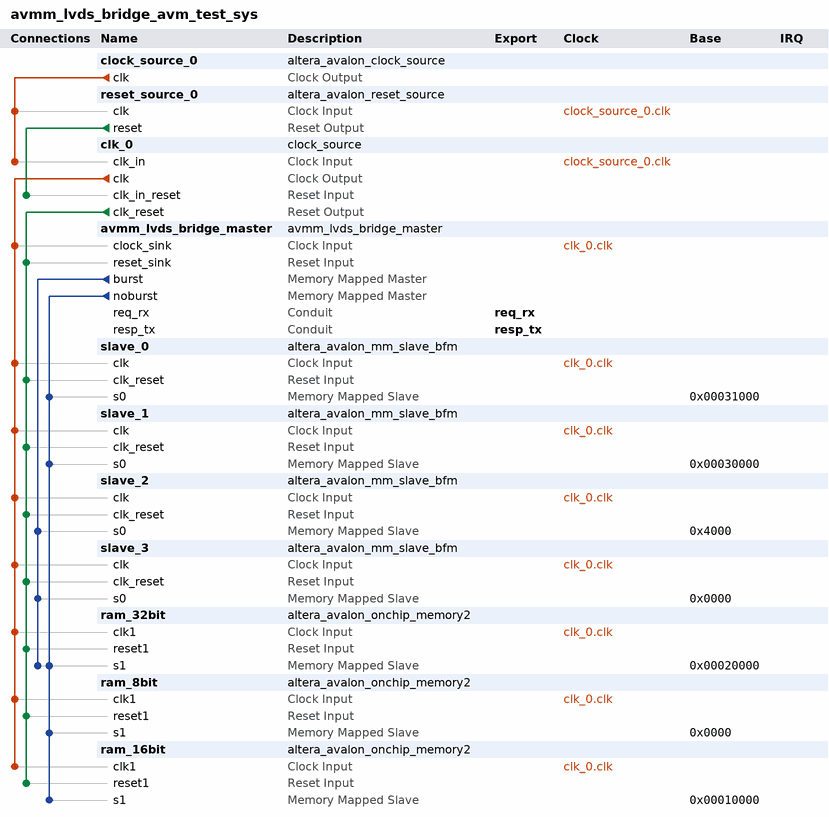
[diagram p0: system contents]
# Platform Designer (Qsys) system avmm_lvds_bridge_avm_test_sys, Cyclone V 5CEBA2F17A7
# Parameters at their usual value, and those the tool derives, are not listed.
package require -exact qsys 15.1
create_system avmm_lvds_bridge_avm_test_sys
set_project_property DEVICE_FAMILY {Cyclone V}
set_project_property DEVICE 5CEBA2F17A7

add_instance clock_source_0 altera_avalon_clock_source 15.1
set_instance_parameter_value clock_source_0 CLOCK_RATE 100
set_instance_parameter_value clock_source_0 CLOCK_UNIT 1000000

add_instance reset_source_0 altera_avalon_reset_source 15.1
set_instance_parameter_value reset_source_0 ASSERT_HIGH_RESET 1
set_instance_parameter_value reset_source_0 INITIAL_RESET_CYCLES 2

add_instance clk_0 clock_source 15.1
set_instance_parameter_value clk_0 clockFrequency 100000000

add_instance avmm_lvds_bridge_master avmm_lvds_bridge_master 1.0
set_instance_parameter_value avmm_lvds_bridge_master ADDR_W 19
set_instance_parameter_value avmm_lvds_bridge_master BURSTCNT_W 11
set_instance_parameter_value avmm_lvds_bridge_master REQ_FACTOR 1
set_instance_parameter_value avmm_lvds_bridge_master RESP_FACTOR 1

add_instance slave_0 altera_avalon_mm_slave_bfm 15.1
set_instance_parameter_value slave_0 ADDRESS_UNITS WORDS
set_instance_parameter_value slave_0 ASSERT_HIGH_ARBITERLOCK 1
set_instance_parameter_value slave_0 ASSERT_HIGH_BYTEENABLE 1
set_instance_parameter_value slave_0 ASSERT_HIGH_LOCK 1
set_instance_parameter_value slave_0 ASSERT_HIGH_READ 1
set_instance_parameter_value slave_0 ASSERT_HIGH_READDATAVALID 1
set_instance_parameter_value slave_0 ASSERT_HIGH_RESET 1
set_instance_parameter_value slave_0 ASSERT_HIGH_WAITREQUEST 1
set_instance_parameter_value slave_0 ASSERT_HIGH_WRITE 1
set_instance_parameter_value slave_0 AV_ADDRESS_W 10
set_instance_parameter_value slave_0 AV_BURSTCOUNT_W 3
set_instance_parameter_value slave_0 AV_BURST_BNDR_ONLY 1
set_instance_parameter_value slave_0 AV_BURST_LINEWRAP 1
set_instance_parameter_value slave_0 AV_FIX_READ_LATENCY 0
set_instance_parameter_value slave_0 AV_MAX_PENDING_READS 1
set_instance_parameter_value slave_0 AV_MAX_PENDING_WRITES 0
set_instance_parameter_value slave_0 AV_NUMSYMBOLS 4
set_instance_parameter_value slave_0 AV_READRESPONSE_W 8
set_instance_parameter_value slave_0 AV_READ_WAIT_TIME 1
set_instance_parameter_value slave_0 AV_REGISTERINCOMINGSIGNALS 0
set_instance_parameter_value slave_0 AV_SYMBOL_W 8
set_instance_parameter_value slave_0 AV_WRITERESPONSE_W 8
set_instance_parameter_value slave_0 AV_WRITE_WAIT_TIME 0
set_instance_parameter_value slave_0 REGISTER_WAITREQUEST 0
set_instance_parameter_value slave_0 USE_ADDRESS 1
set_instance_parameter_value slave_0 USE_ARBITERLOCK 0
set_instance_parameter_value slave_0 USE_BEGIN_BURST_TRANSFER 0
set_instance_parameter_value slave_0 USE_BEGIN_TRANSFER 0
set_instance_parameter_value slave_0 USE_BURSTCOUNT 1
set_instance_parameter_value slave_0 USE_BYTE_ENABLE 1
set_instance_parameter_value slave_0 USE_CLKEN 0
set_instance_parameter_value slave_0 USE_DEBUGACCESS 0
set_instance_parameter_value slave_0 USE_LOCK 0
set_instance_parameter_value slave_0 USE_READ 1
set_instance_parameter_value slave_0 USE_READRESPONSE 0
set_instance_parameter_value slave_0 USE_READ_DATA 1
set_instance_parameter_value slave_0 USE_READ_DATA_VALID 1
set_instance_parameter_value slave_0 USE_TRANSACTIONID 0
set_instance_parameter_value slave_0 USE_WAIT_REQUEST 1
set_instance_parameter_value slave_0 USE_WRITE 1
set_instance_parameter_value slave_0 USE_WRITERESPONSE 0
set_instance_parameter_value slave_0 USE_WRITE_DATA 1
set_instance_parameter_value slave_0 VHDL_ID 0

add_instance slave_1 altera_avalon_mm_slave_bfm 15.1
set_instance_parameter_value slave_1 ADDRESS_UNITS WORDS
set_instance_parameter_value slave_1 ASSERT_HIGH_ARBITERLOCK 1
set_instance_parameter_value slave_1 ASSERT_HIGH_BYTEENABLE 1
set_instance_parameter_value slave_1 ASSERT_HIGH_LOCK 1
set_instance_parameter_value slave_1 ASSERT_HIGH_READ 1
set_instance_parameter_value slave_1 ASSERT_HIGH_READDATAVALID 1
set_instance_parameter_value slave_1 ASSERT_HIGH_RESET 1
set_instance_parameter_value slave_1 ASSERT_HIGH_WAITREQUEST 1
set_instance_parameter_value slave_1 ASSERT_HIGH_WRITE 1
set_instance_parameter_value slave_1 AV_ADDRESS_W 10
set_instance_parameter_value slave_1 AV_BURSTCOUNT_W 3
set_instance_parameter_value slave_1 AV_BURST_BNDR_ONLY 1
set_instance_parameter_value slave_1 AV_BURST_LINEWRAP 1
set_instance_parameter_value slave_1 AV_FIX_READ_LATENCY 0
set_instance_parameter_value slave_1 AV_MAX_PENDING_READS 1
set_instance_parameter_value slave_1 AV_MAX_PENDING_WRITES 0
set_instance_parameter_value slave_1 AV_NUMSYMBOLS 4
set_instance_parameter_value slave_1 AV_READRESPONSE_W 8
set_instance_parameter_value slave_1 AV_READ_WAIT_TIME 1
set_instance_parameter_value slave_1 AV_REGISTERINCOMINGSIGNALS 0
set_instance_parameter_value slave_1 AV_SYMBOL_W 8
set_instance_parameter_value slave_1 AV_WRITERESPONSE_W 8
set_instance_parameter_value slave_1 AV_WRITE_WAIT_TIME 0
set_instance_parameter_value slave_1 REGISTER_WAITREQUEST 0
set_instance_parameter_value slave_1 USE_ADDRESS 1
set_instance_parameter_value slave_1 USE_ARBITERLOCK 0
set_instance_parameter_value slave_1 USE_BEGIN_BURST_TRANSFER 0
set_instance_parameter_value slave_1 USE_BEGIN_TRANSFER 0
set_instance_parameter_value slave_1 USE_BURSTCOUNT 1
set_instance_parameter_value slave_1 USE_BYTE_ENABLE 1
set_instance_parameter_value slave_1 USE_CLKEN 0
set_instance_parameter_value slave_1 USE_DEBUGACCESS 0
set_instance_parameter_value slave_1 USE_LOCK 0
set_instance_parameter_value slave_1 USE_READ 1
set_instance_parameter_value slave_1 USE_READRESPONSE 0
set_instance_parameter_value slave_1 USE_READ_DATA 1
set_instance_parameter_value slave_1 USE_READ_DATA_VALID 1
set_instance_parameter_value slave_1 USE_TRANSACTIONID 0
set_instance_parameter_value slave_1 USE_WAIT_REQUEST 1
set_instance_parameter_value slave_1 USE_WRITE 1
set_instance_parameter_value slave_1 USE_WRITERESPONSE 0
set_instance_parameter_value slave_1 USE_WRITE_DATA 1
set_instance_parameter_value slave_1 VHDL_ID 0

add_instance slave_2 altera_avalon_mm_slave_bfm 15.1
set_instance_parameter_value slave_2 ADDRESS_UNITS WORDS
set_instance_parameter_value slave_2 ASSERT_HIGH_ARBITERLOCK 1
set_instance_parameter_value slave_2 ASSERT_HIGH_BYTEENABLE 1
set_instance_parameter_value slave_2 ASSERT_HIGH_LOCK 1
set_instance_parameter_value slave_2 ASSERT_HIGH_READ 1
set_instance_parameter_value slave_2 ASSERT_HIGH_READDATAVALID 1
set_instance_parameter_value slave_2 ASSERT_HIGH_RESET 1
set_instance_parameter_value slave_2 ASSERT_HIGH_WAITREQUEST 1
set_instance_parameter_value slave_2 ASSERT_HIGH_WRITE 1
set_instance_parameter_value slave_2 AV_ADDRESS_W 12
set_instance_parameter_value slave_2 AV_BURSTCOUNT_W 11
set_instance_parameter_value slave_2 AV_BURST_BNDR_ONLY 1
set_instance_parameter_value slave_2 AV_BURST_LINEWRAP 1
set_instance_parameter_value slave_2 AV_FIX_READ_LATENCY 0
set_instance_parameter_value slave_2 AV_MAX_PENDING_READS 1
set_instance_parameter_value slave_2 AV_MAX_PENDING_WRITES 0
set_instance_parameter_value slave_2 AV_NUMSYMBOLS 4
set_instance_parameter_value slave_2 AV_READRESPONSE_W 8
set_instance_parameter_value slave_2 AV_READ_WAIT_TIME 1
set_instance_parameter_value slave_2 AV_REGISTERINCOMINGSIGNALS 0
set_instance_parameter_value slave_2 AV_SYMBOL_W 8
set_instance_parameter_value slave_2 AV_WRITERESPONSE_W 8
set_instance_parameter_value slave_2 AV_WRITE_WAIT_TIME 0
set_instance_parameter_value slave_2 REGISTER_WAITREQUEST 0
set_instance_parameter_value slave_2 USE_ADDRESS 1
set_instance_parameter_value slave_2 USE_ARBITERLOCK 0
set_instance_parameter_value slave_2 USE_BEGIN_BURST_TRANSFER 0
set_instance_parameter_value slave_2 USE_BEGIN_TRANSFER 0
set_instance_parameter_value slave_2 USE_BURSTCOUNT 1
set_instance_parameter_value slave_2 USE_BYTE_ENABLE 1
set_instance_parameter_value slave_2 USE_CLKEN 0
set_instance_parameter_value slave_2 USE_DEBUGACCESS 0
set_instance_parameter_value slave_2 USE_LOCK 0
set_instance_parameter_value slave_2 USE_READ 1
set_instance_parameter_value slave_2 USE_READRESPONSE 0
set_instance_parameter_value slave_2 USE_READ_DATA 1
set_instance_parameter_value slave_2 USE_READ_DATA_VALID 1
set_instance_parameter_value slave_2 USE_TRANSACTIONID 0
set_instance_parameter_value slave_2 USE_WAIT_REQUEST 1
set_instance_parameter_value slave_2 USE_WRITE 1
set_instance_parameter_value slave_2 USE_WRITERESPONSE 0
set_instance_parameter_value slave_2 USE_WRITE_DATA 1
set_instance_parameter_value slave_2 VHDL_ID 0

add_instance slave_3 altera_avalon_mm_slave_bfm 15.1
set_instance_parameter_value slave_3 ADDRESS_UNITS WORDS
set_instance_parameter_value slave_3 ASSERT_HIGH_ARBITERLOCK 1
set_instance_parameter_value slave_3 ASSERT_HIGH_BYTEENABLE 1
set_instance_parameter_value slave_3 ASSERT_HIGH_LOCK 1
set_instance_parameter_value slave_3 ASSERT_HIGH_READ 1
set_instance_parameter_value slave_3 ASSERT_HIGH_READDATAVALID 1
set_instance_parameter_value slave_3 ASSERT_HIGH_RESET 1
set_instance_parameter_value slave_3 ASSERT_HIGH_WAITREQUEST 1
set_instance_parameter_value slave_3 ASSERT_HIGH_WRITE 1
set_instance_parameter_value slave_3 AV_ADDRESS_W 12
set_instance_parameter_value slave_3 AV_BURSTCOUNT_W 10
set_instance_parameter_value slave_3 AV_BURST_BNDR_ONLY 1
set_instance_parameter_value slave_3 AV_BURST_LINEWRAP 1
set_instance_parameter_value slave_3 AV_FIX_READ_LATENCY 0
set_instance_parameter_value slave_3 AV_MAX_PENDING_READS 1
set_instance_parameter_value slave_3 AV_MAX_PENDING_WRITES 0
set_instance_parameter_value slave_3 AV_NUMSYMBOLS 4
set_instance_parameter_value slave_3 AV_READRESPONSE_W 8
set_instance_parameter_value slave_3 AV_READ_WAIT_TIME 1
set_instance_parameter_value slave_3 AV_REGISTERINCOMINGSIGNALS 0
set_instance_parameter_value slave_3 AV_SYMBOL_W 8
set_instance_parameter_value slave_3 AV_WRITERESPONSE_W 8
set_instance_parameter_value slave_3 AV_WRITE_WAIT_TIME 0
set_instance_parameter_value slave_3 REGISTER_WAITREQUEST 0
set_instance_parameter_value slave_3 USE_ADDRESS 1
set_instance_parameter_value slave_3 USE_ARBITERLOCK 0
set_instance_parameter_value slave_3 USE_BEGIN_BURST_TRANSFER 0
set_instance_parameter_value slave_3 USE_BEGIN_TRANSFER 0
set_instance_parameter_value slave_3 USE_BURSTCOUNT 1
set_instance_parameter_value slave_3 USE_BYTE_ENABLE 1
set_instance_parameter_value slave_3 USE_CLKEN 0
set_instance_parameter_value slave_3 USE_DEBUGACCESS 0
set_instance_parameter_value slave_3 USE_LOCK 0
set_instance_parameter_value slave_3 USE_READ 1
set_instance_parameter_value slave_3 USE_READRESPONSE 0
set_instance_parameter_value slave_3 USE_READ_DATA 1
set_instance_parameter_value slave_3 USE_READ_DATA_VALID 1
set_instance_parameter_value slave_3 USE_TRANSACTIONID 0
set_instance_parameter_value slave_3 USE_WAIT_REQUEST 1
set_instance_parameter_value slave_3 USE_WRITE 1
set_instance_parameter_value slave_3 USE_WRITERESPONSE 0
set_instance_parameter_value slave_3 USE_WRITE_DATA 1
set_instance_parameter_value slave_3 VHDL_ID 0

add_instance ram_32bit altera_avalon_onchip_memory2 15.1
set_instance_parameter_value ram_32bit dataWidth 32
set_instance_parameter_value ram_32bit dualPort false
set_instance_parameter_value ram_32bit initMemContent false
set_instance_parameter_value ram_32bit initializationFileName onchip_mem.hex
set_instance_parameter_value ram_32bit memorySize 65536

add_instance ram_8bit altera_avalon_onchip_memory2 15.1
set_instance_parameter_value ram_8bit dataWidth 8
set_instance_parameter_value ram_8bit dualPort false
set_instance_parameter_value ram_8bit initMemContent false
set_instance_parameter_value ram_8bit initializationFileName onchip_mem.hex
set_instance_parameter_value ram_8bit memorySize 4096

add_instance ram_16bit altera_avalon_onchip_memory2 15.1
set_instance_parameter_value ram_16bit dataWidth 16
set_instance_parameter_value ram_16bit dualPort false
set_instance_parameter_value ram_16bit initMemContent false
set_instance_parameter_value ram_16bit initializationFileName onchip_mem.hex
set_instance_parameter_value ram_16bit memorySize 4096

# connections
add_connection clk_0.clk avmm_lvds_bridge_master.clock_sink clock
add_connection clk_0.clk ram_8bit.clk1 clock
add_connection clk_0.clk ram_16bit.clk1 clock
add_connection clk_0.clk ram_32bit.clk1 clock
add_connection clk_0.clk slave_0.clk clock
add_connection clk_0.clk slave_1.clk clock
add_connection clk_0.clk slave_2.clk clock
add_connection clk_0.clk slave_3.clk clock
add_connection clock_source_0.clk clk_0.clk_in clock
add_connection clock_source_0.clk reset_source_0.clk clock
add_connection clk_0.clk_reset avmm_lvds_bridge_master.reset_sink reset
add_connection clk_0.clk_reset ram_8bit.reset1 reset
add_connection clk_0.clk_reset ram_16bit.reset1 reset
add_connection clk_0.clk_reset ram_32bit.reset1 reset
add_connection clk_0.clk_reset slave_0.clk_reset reset
add_connection clk_0.clk_reset slave_1.clk_reset reset
add_connection clk_0.clk_reset slave_2.clk_reset reset
add_connection clk_0.clk_reset slave_3.clk_reset reset
add_connection reset_source_0.reset clk_0.clk_in_reset reset
add_connection avmm_lvds_bridge_master.burst ram_32bit.s1 avalon
set_connection_parameter_value avmm_lvds_bridge_master.burst/ram_32bit.s1 baseAddress 0x00020000
add_connection avmm_lvds_bridge_master.burst slave_2.s0 avalon
set_connection_parameter_value avmm_lvds_bridge_master.burst/slave_2.s0 baseAddress 0x4000
add_connection avmm_lvds_bridge_master.burst slave_3.s0 avalon
set_connection_parameter_value avmm_lvds_bridge_master.burst/slave_3.s0 baseAddress 0x0000
add_connection avmm_lvds_bridge_master.noburst ram_8bit.s1 avalon
set_connection_parameter_value avmm_lvds_bridge_master.noburst/ram_8bit.s1 baseAddress 0x0000
add_connection avmm_lvds_bridge_master.noburst ram_16bit.s1 avalon
set_connection_parameter_value avmm_lvds_bridge_master.noburst/ram_16bit.s1 baseAddress 0x00010000
add_connection avmm_lvds_bridge_master.noburst ram_32bit.s1 avalon
set_connection_parameter_value avmm_lvds_bridge_master.noburst/ram_32bit.s1 baseAddress 0x00020000
add_connection avmm_lvds_bridge_master.noburst slave_0.s0 avalon
set_connection_parameter_value avmm_lvds_bridge_master.noburst/slave_0.s0 baseAddress 0x00031000
add_connection avmm_lvds_bridge_master.noburst slave_1.s0 avalon
set_connection_parameter_value avmm_lvds_bridge_master.noburst/slave_1.s0 baseAddress 0x00030000

# exported interfaces
add_interface req_rx conduit end
set_interface_property req_rx EXPORT_OF avmm_lvds_bridge_master.req_rx
add_interface resp_tx conduit end
set_interface_property resp_tx EXPORT_OF avmm_lvds_bridge_master.resp_tx

set_interconnect_requirement {$system} qsys_mm.clockCrossingAdapter HANDSHAKE
set_interconnect_requirement {$system} qsys_mm.enableEccProtection FALSE
set_interconnect_requirement {$system} qsys_mm.insertDefaultSlave FALSE
set_interconnect_requirement {$system} qsys_mm.maxAdditionalLatency 1

save_system avmm_lvds_bridge_avm_test_sys.qsys
